# EAGLE design HirigrandeCHINA V2.1 (EAGLE 9.6.2)
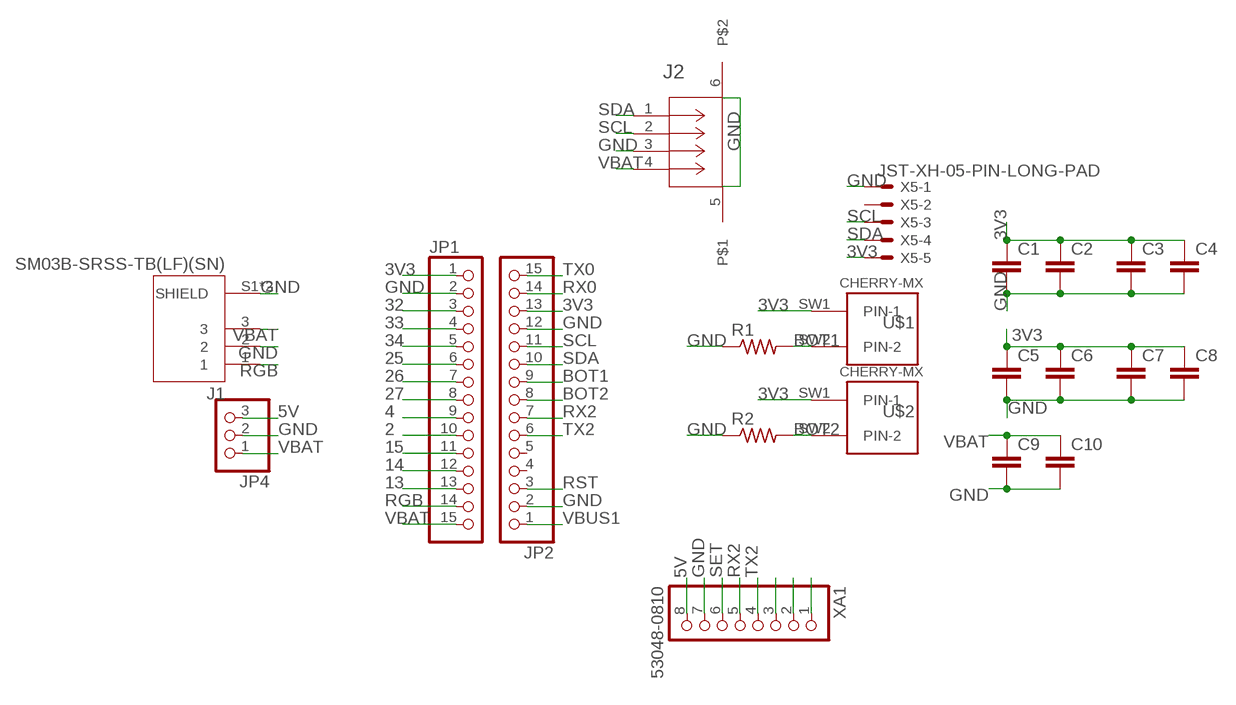
[diagram p0: schematic, sheet 1]

## Parts
C1  C-EUC4532  [C4532]
C2  C-EUC4532  [C4532]
C3  C-EUC4532  [C4532]
C4  C-EUC4532  [C4532]
C5  C-EUC4532  [C4532]
C6  C-EUC4532  [C4532]
C7  C-EUC4532  [C4532]
C8  C-EUC4532  [C4532]
C9  C-EUC4532  [C4532]
C10  C-EUC4532  [C4532]
J1  SM03B-SRSS-TB(LF)(SN)  [JST_SM03B-SRSS-TB(LF)(SN)]
J2  SM04B-SRSS-TB  [CONN_SM04B-SRSS-TB_JST]
JP1  PINHD-1X15  [1X15]
JP2  PINHD-1X15  [1X15]
JP4  PINHD-1X3  [1X03]
R1  R-US_0204/7  [0204/7]
R2  R-US_0204/7  [0204/7]
U$1  CHERRY-MX  [CHERRY-MX]
U$2  CHERRY-MX  [CHERRY-MX]
X5  JST-XH-05-PIN-LONG-PAD  [JST-XH-05-PACKAGE-LONG-PAD]
XA1  53048-0810  [MOLEX_53048-0810]

## Nets
2: JP1.10
3V3: C1.1 C2.1 C3.1 C4.1 C5.1 C6.1 C7.1 C8.1 JP1.1 JP2.13 U$1.SW1(PIN-1) U$2.SW1(PIN-1) X5.5
4: JP1.9
5V: JP4.3 XA1.8
13: JP1.13
14: JP1.12
15: JP1.11
25: JP1.6
26: JP1.7
27: JP1.8
32: JP1.3
33: JP1.4
34: JP1.5
BOT1: JP2.9 R1.2 U$1.SW2(PIN-2)
BOT2: JP2.8 R2.2 U$2.SW2(PIN-2)
GND: C1.2 C2.2 C3.2 C4.2 C5.2 C6.2 C7.2 C8.2 C9.2 C10.2 J1.2 J1.S1(SHIELD) J1.S2(SHIELD) J2.3 J2.5 J2.6 JP1.2 JP2.2 JP2.12 JP4.2 R1.1 R2.1 X5.1 XA1.7
N$6: XA1.3
N$7: XA1.2
N$8: XA1.1
RGB: J1.1 JP1.14
RST: JP2.3
RX0: JP2.14
RX2: JP2.7 XA1.5
SCL: J2.2 JP2.11 X5.3
SDA: J2.1 JP2.10 X5.4
SET: XA1.6
TX0: JP2.15
TX2: JP2.6 XA1.4
VBAT: C9.1 C10.1 J1.3 J2.4 JP1.15 JP4.1
VBUS1: JP2.1
Unconnected: JP2.4 JP2.5 X5.2

## Library data of the parts
C1-C10 = rcl:C-EU: CAPACITOR, European symbol; SPICEPREFIX: C
J1 = SM03B-SRSS-TB_LF__SN_:SM03B-SRSS-TB(LF)(SN): Check availability <https://pricing.snapeda.com/parts/SM03B-SRSS-TB%28LF%29%28SN%29/JST%20Sales%20America%20Inc./view-part?ref=eda>; AVAILABILITY: In Stock; CHECK_PRICES: https://www.snapeda.com/parts/SM03B-SRSS-TB(LF)(SN)/JST/view-part/?ref=eda; DESCRIPTION: Connector Header Surface Mount, Right Angle 3 position 0.039 (1.00mm); MF: JST Sales America Inc.; MP: SM03B-SRSS-TB(LF)(SN); PACKAGE: None; PRICE: None; SNAPEDA_LINK: https://www.snapeda.com/parts/SM03B-SRSS-TB(LF)(SN)/JST/view-part/?ref=snap
J2 = SM04B-SRSS-TB:SM04B-SRSS-TB: Check availability <https://pricing.snapeda.com/parts/SM04B-SRSS-TB/JST%20Sales/view-part?ref=eda>; AVAILABILITY: In Stock; CHECK_PRICES: https://www.snapeda.com/parts/SM04B-SRSS-TB/JST/view-part/?ref=eda; DESCRIPTION: Connector Header Surface Mount, Right Angle 4 position 0.039 (1.00mm); MF: JST Sales; MP: SM04B-SRSS-TB; PACKAGE: None; PRICE: None; SNAPEDA_LINK: https://www.snapeda.com/parts/SM04B-SRSS-TB/JST/view-part/?ref=snap
JP1 JP2 = pinhead:PINHD-1X15: PIN HEADER
JP4 = adafruit:PINHD-1X3: PIN HEADER
R1 R2 = adafruit:R-US_: RESISTOR, American symbol
U$1 U$2 = cherrymx:CHERRY-MX: Cherry MX series keyswitch
X5 = Rembrandt Electronics - JST XH Connectors v1-0:JST-XH-05-PIN: JST XH Connector 2 Pin Wire to board connector. Pitch: 2,54 mm, (0.100") Number of pins: 5 Created by Rembrandt Electronics www.rembrandtelectronics.com
XA1 = ConectorPlantower:53048-0810: 1.25mm Pitch PicoBlade Header, Right Angle, 8 Circuits Check availability <https://pricing.snapeda.com/parts/53048-0810/Molex/view-part?ref=eda>; AVAILABILITY: In Stock; CHECK_PRICES: https://www.snapeda.com/parts/53048-0810/Molex/view-part/?ref=eda; DESCRIPTION: 8 way through board PCB 90deg header | Molex Incorporated 53048-0810; MF: Molex; MP: 53048-0810; PACKAGE: None; PRICE: None; PURCHASE-URL: https://www.snapeda.com/api/url_track_click_mouser/?unipart_id=53851&manufacturer=Molex&part_name=53048-0810&search_term=picoblade 1.25mm header rightangle 8way; SNAPEDA_LINK: https://www.snapeda.com/parts/53048-0810/Molex/view-part/?ref=snap

## Board
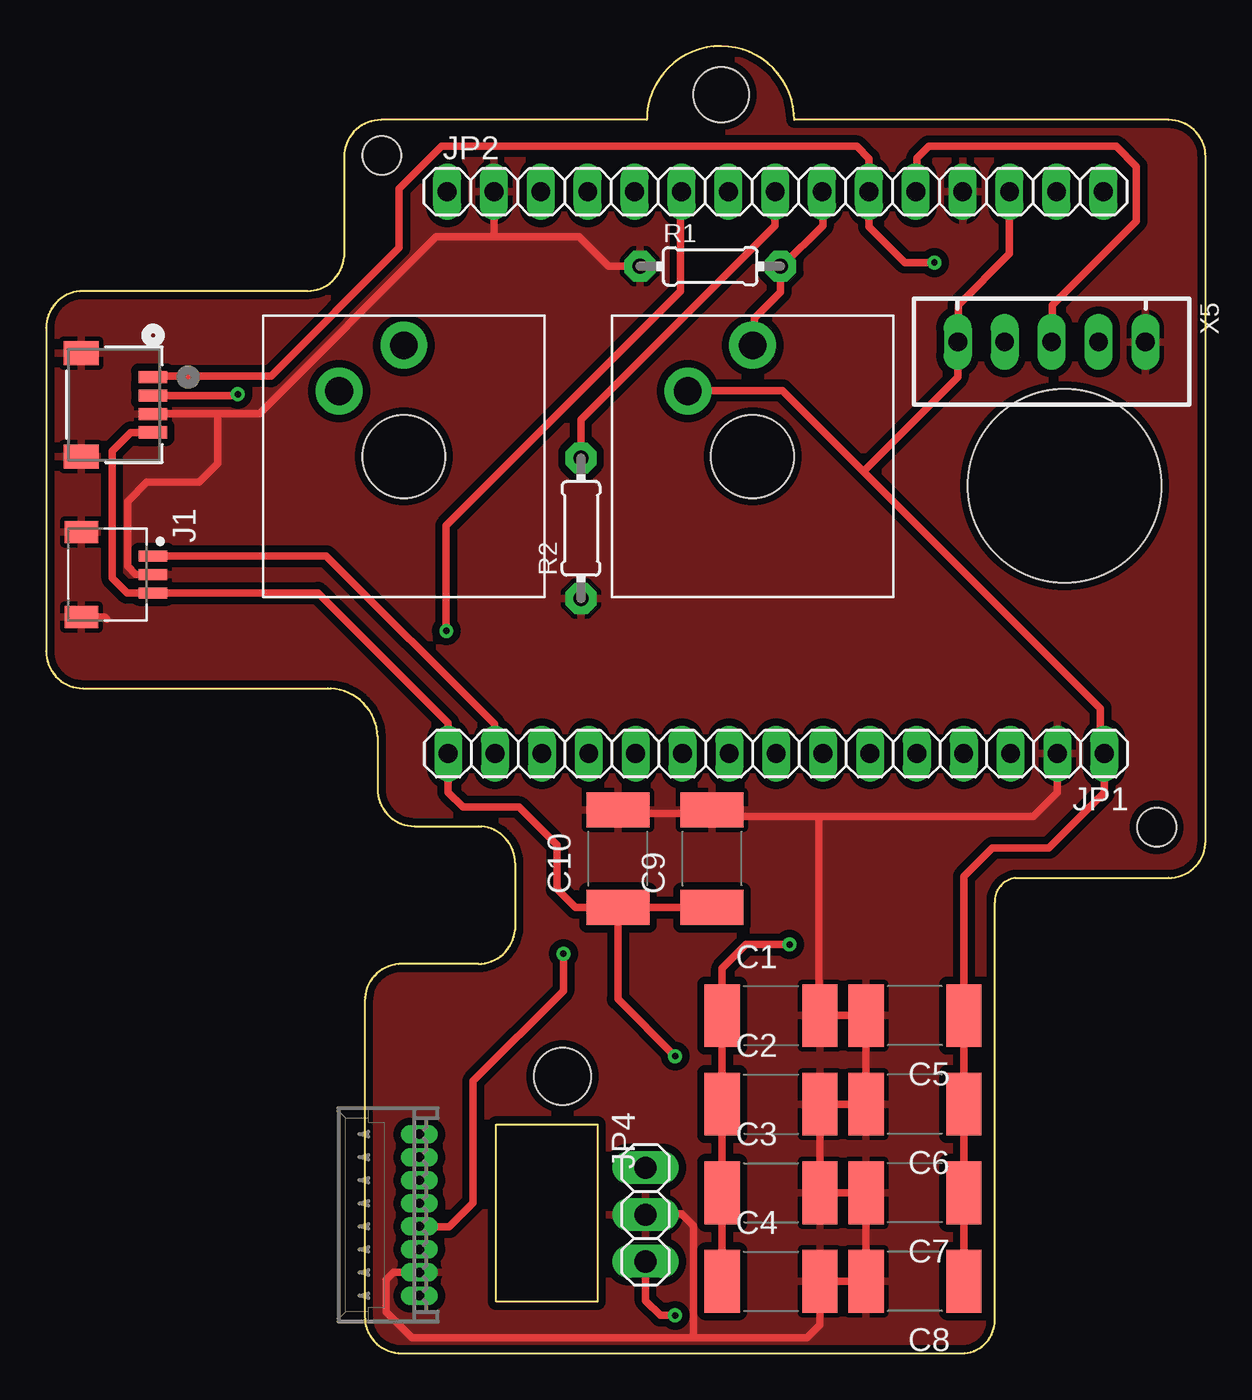
[diagram p1: board, top side]
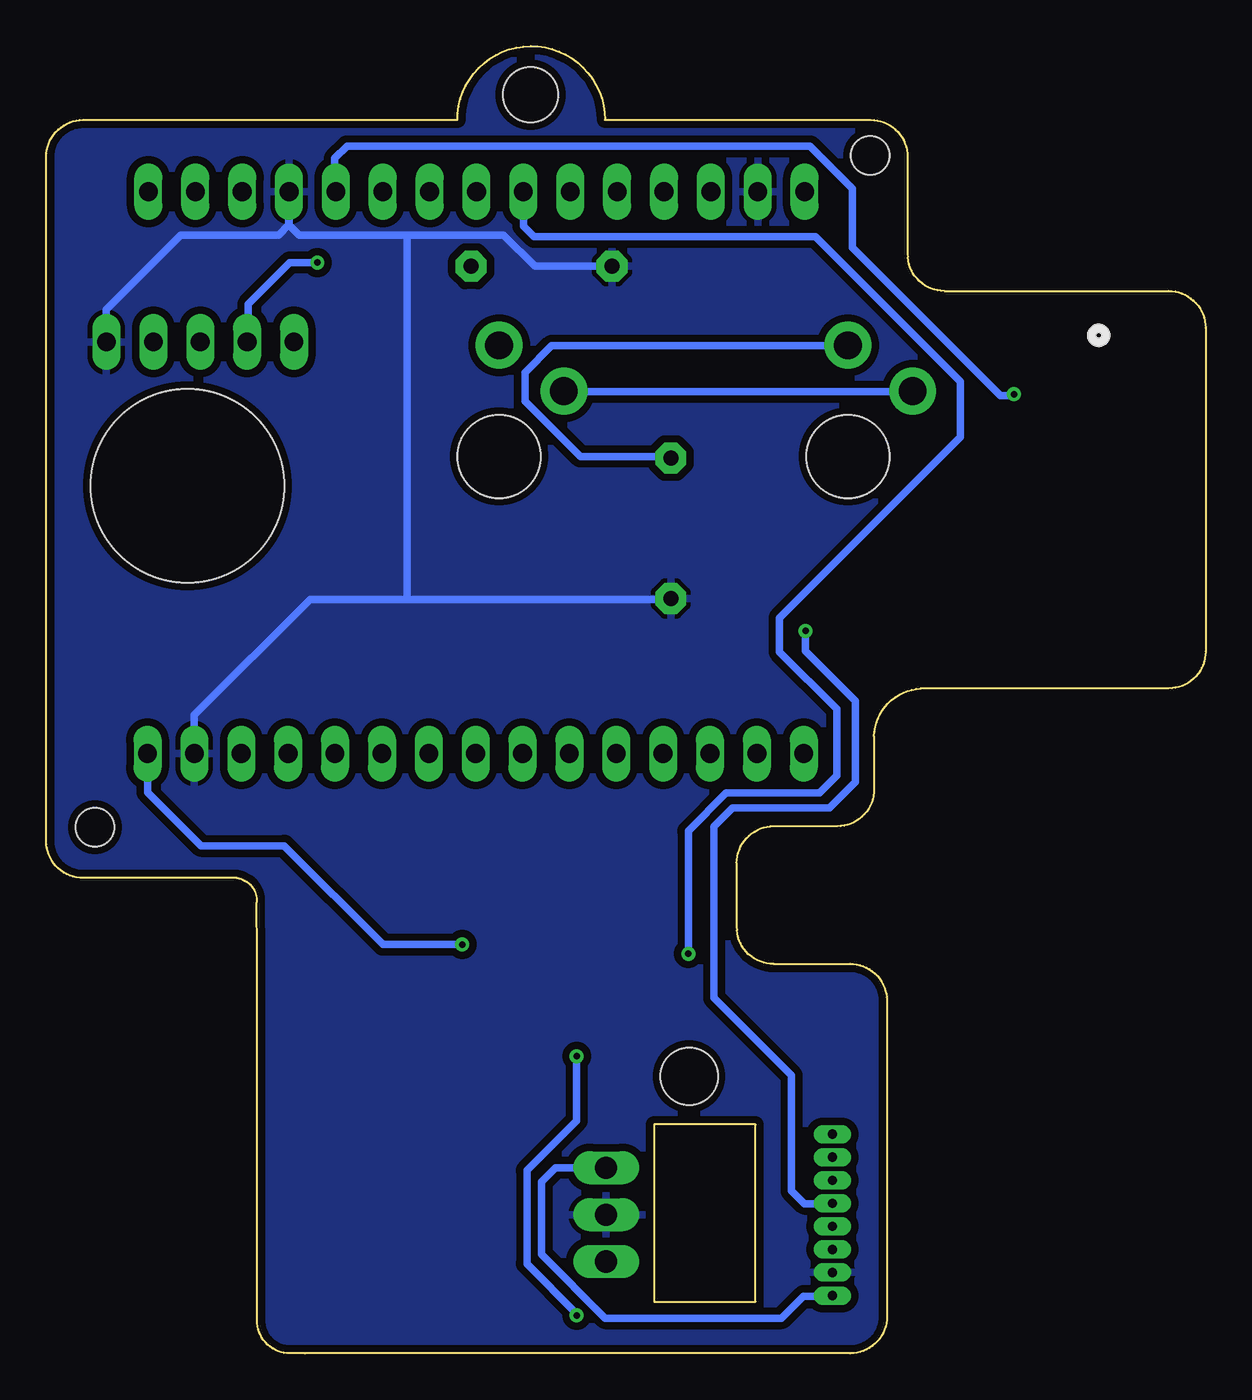
[diagram p2: board, bottom side, seen from below]

Size 62.83 x 70.84 mm. Coordinates in mm from the lower left corner, seen from the top.
Outline: 24.39,2.8 24.39,12.4 29.89,12.4 29.89,2.8 24.39,2.8
Outline: 14.15,57.57 2,57.57 1.83,57.56 arc85 0,55.57 0,38.04 arc90 2,36.04 15.26,36.04 15.44,36.03 arc-85 17.96,33.44 17.96,30.56 17.97,30.39 arc85 19.96,28.56 23.41,28.56 23.59,28.55 arc-85 25.41,26.56 25.41,23.1 25.4,22.93 arc-85 23.41,21.1 19.26,21.1 19.09,21.1 arc85 17.26,19.1 17.26,2 17.27,1.83 arc85 19.26,0 48.81,0 49.78,0.01 arc85 51.41,1.8 51.41,21.66 51.42,24.44 arc-85 52.51,25.76 60.83,25.76 61.01,25.77 arc85 62.83,27.76 62.83,64.84 62.83,65.01 arc85 60.83,66.84 40.55,66.84 40.53,67.18 arc175 32.55,66.84 18.15,66.84 17.98,66.83 arc85 16.15,64.84 16.15,59.57 16.14,59.39 arc-85 14.15,57.57
Copper layers (1*16): Top 0.035mm / dielectric 1.5mm / Bottom 0.035mm
Design rules "default *": minimum track width 0.4mm, minimum drill 0.35mm, track to track 0.4mm, track to pad 0.4mm, pad to pad 0.4mm, via to via 0.4mm, smd to smd 6mil, copper to edge 0.4mm, drill to drill 6mil, minimum pad ring 10mil, minimum via ring 8mil, stop-mask expansion 4mil, vias tented up to drill 0mil, thermal gap 10mil
Holes 4.5 mm at 38.29,48.6 19.39,48.6
Holes 10.5 mm at 55.19,47
Holes 2.1 mm at 18.19,64.9 60.19,28.5
Holes 3.1 mm at 27.99,15
Holes 3 mm at 36.59,68.2

### Footprints (pad centres in the part's own frame; a part is rotated, then mirrored left to right if it is on the bottom)
C4532 = smd 1.9 x 3.4: 1 -2.65,0; 2 2.65,0
JST_SM03B-SRSS-TB(LF)(SN) = smd 0.6 x 1.55: 1 -1,0; 2 0,0; 3 1,0 | smd 1.2 x 1.8: S1 -2.3,-3.875; S2 2.3,-3.875
CONN_SM04B-SRSS-TB_JST = smd 0.66 x 1.549: 1 1.5,-2.099; 2 0.5,-2.099; 3 -0.5,-2.099; 4 -1.5,-2.099 | smd 1.295 x 1.905: 5 -2.8,1.776; 6 2.8,1.776
1X15 = drill 1.016 long: 1 -17.78,0; 2 -15.24,0; 3 -12.7,0; 4 -10.16,0; 5 -7.62,0; 6 -5.08,0; 7 -2.54,0; 8 0,0; 9 2.54,0; 10 5.08,0; 11 7.62,0; 12 10.16,0; 13 12.7,0; 14 15.24,0; 15 17.78,0
1X03 = drill 1.2 pad 1.676 long: 1 -2.54,0; 2 0,0; 3 2.54,0
0204/7 = drill 0.813 pad 1.676 octagon: 1 -3.81,0; 2 3.81,0
CHERRY-MX = drill 1.5 pad 2.54: SW1 -3.51,3.54; SW2 0,6.02 | hole 4.5: 0,0
JST-XH-05-PACKAGE-LONG-PAD = drill 1.016 long: 1 -5.08,0; 2 -2.54,0; 3 0,0; 4 2.54,0; 5 5.08,0
MOLEX_53048-0810 = drill 0.5 pad 0.762 long: 1 4.375,0.02; 2 3.125,0.02; 3 1.875,0.02; 4 0.625,0.02; 5 -0.625,0.02; 6 -1.875,0.02; 7 -3.125,0.02; 8 -4.375,0.02

### Placement (x,y rotation side)
C1  39.29,18.3 0 top
C2  39.29,13.5 0 top
C3  39.29,8.7 0 top
C4  39.29,3.9 0 top
C5  47.09,18.3 180 top
C6  47.09,13.5 180 top
C7  47.09,8.7 180 top
C8  47.09,3.9 180 top
C9  36.09,26.8 90 top
C10  30.99,26.8 90 top
J1  5.79,42.2 270 top
J2  3.69,51.4 90 top
JP1  39.56,32.5 180 top
JP2  39.51,62.95 0 top
JP4  32.49,7.52 90 top
R1  35.99,58.9 0 top
R2  28.99,44.7 90 top
U$1  38.29,48.6 0 top
U$2  19.39,48.6 0 top
X5  54.49,54.8 180 top
XA1  20.24,7.5 90 top

### Tracks (layer width: path | path; a pad name or v marks a point on that pad's centre or on a via)
3V3  (via drill 0.35)
  Top 0.4: 49.14,8.6 49.65,8.69 | 49.65,8.69 C7.1 C8.1 | 49.14,18.35 C5.1 | 49.14,18.1 C5.1 | 49.14,13.35 49.71,13.5 | 49.71,13.5 C6.1 49.74,8.77 49.65,8.69 | JP2.13 52.21,59.58 49.44,56.8 49.44,54.83 X5.5 49.41,52.9 44.3,47.79 | U$1.SW1 34.81,52.18 39.91,52.18 44.3,47.79 | 44.3,47.79 57.14,34.95 57.14,32.6 JP1.1 57.34,30.4 54.34,27.4 51.28,27.4 49.74,25.85 C5.1 | C5.1 49.74,13.52 49.71,13.5 | C4.1 C3.1 C2.1 C1.1 36.64,20.85 37.94,22.15 v40.29,22.15 | C4.1 36.64,3.35 36.59,3.3 36.59,3.85 C4.1
  Bottom 0.4: v40.29,22.15 44.59,22.15 49.93,27.5 54.44,27.5 57.34,30.4 JP1.1 | U$2.SW1 15.89,52.1 34.64,52.1 U$1.SW1
5V
  Bottom 0.4: XA1.8 20.24,3.1 21.79,3.1 22.99,1.9 32.54,1.9 35.99,5.35 35.99,9.3 35.24,10.05 JP4.3
BOT1
  Top 0.4: JP2.9 42.09,62.92 42.09,61.1 39.89,58.9 R1.2 39.8,57.51 38.39,56.1 38.39,54.85 U$1.SW2
BOT2
  Top 0.4: JP2.8 39.49,62.93 39.49,61.1 28.99,50.6 R2.2
  Bottom 0.4: U$2.SW2 19.39,54.6 35.44,54.6 36.89,53.15 36.89,51.6 33.89,48.6 29.14,48.6 R2.2
GND
  Top 0.4: 44.8,8.68 C7.2 C8.2 C4.2 | 44.8,8.68 45.09,8.65 | 42.39,13.6 41.89,13.6 | 41.89,13.6 41.29,13.6 C2.2 | 45.14,13.6 C6.2 | 42.39,8.6 C3.2 | 42.39,13.4 C2.2 | XA1.7 18.82,4.38 18.42,3.98 18.42,2.27 19.84,0.85 35.09,0.85 | JP4.2 32.52,7.55 34.44,7.55 35.09,6.9 35.09,0.85 | 42.39,4.04 C4.2 | C10.2 31.04,29.25 36.02,29.25 C9.2 36.11,29.1 41.89,29.1 | JP1.2 54.8,30.4 53.5,29.1 41.89,29.1 | R1.1 30.49,58.9 28.89,60.5 24.39,60.5 | 24.39,60.5 21.14,60.5 11.57,50.93 9.29,50.93 | 24.39,60.5 24.26,60.63 24.26,62.94 JP2.2 | C6.2 C5.2 C1.2 41.89,18.35 41.89,29.1 | C6.2 41.99,13.5 41.89,13.6 | C2.2 C3.2 | C3.2 44.77,8.7 44.8,8.68 | 35.09,0.85 41.24,0.85 41.94,1.55 C4.2 | J1.2 4.86,42.2 4.41,42.66 4.41,46.15 5.46,47.2 8.29,47.2 9.29,48.2 9.29,50.93 | J2.3 5.81,50.93 9.29,50.93 | J1.S2 3.19,39.9 3.29,39.8
  Bottom 0.4: 43.29,40.85 48.54,40.85 54.8,34.59 JP1.2 | 43.29,40.85 29.14,40.85 R2.1 | X5.1 59.59,54.82 59.59,56.55 55.54,60.6 50.24,60.6 49.69,61.15 49.69,62.94 JP2.12 49.67,61.14 49.14,60.6 43.29,60.6 | 43.29,60.6 38.04,60.6 36.34,58.9 R1.1 | 43.29,60.6 43.29,40.85
  pour Top: -1.21,70.9 58.89,70.9 64.49,65.3 64.49,27.1 61.39,24 53.79,24 52.19,22.4 52.19,1.2 49.19,-1.8 18.69,-1.8 16.39,0.5 16.39,33.5 14.89,35 1.39,35 -1.71,38.1 -1.71,56.6 -1.21,57.1
  pour Bottom: 0.39,59.2 13.49,59.2 15.19,60.9 15.19,65.4 14.99,65.6 20.69,71.3 57.89,71.3 64.49,64.7 64.49,27.1 61.79,24.4 55.49,24.4 52.89,21.8 52.89,2.2 49.29,-1.4 19.09,-1.4 14.59,3.1 14.59,17.3 14.59,31.9 12.49,34 0.19,34 -2.31,36.5 -2.31,56.5
RGB
  Top 0.4: JP1.14 24.29,32.53 24.29,34.1 15.19,43.2 J1.1
RX2  (via drill 0.35)
  Top 0.4: v28.04,21.65 28.04,19.65 23.14,14.75 23.14,8.15 21.84,6.85 20.24,6.85 XA1.5
  Bottom 0.4: v28.04,21.65 28.04,28.3 25.99,30.35 20.94,30.35 19.99,31.3 19.99,34.9 23.09,38 23.09,39.85 13.29,49.65 13.29,52.65 21.14,60.5 36.39,60.5 36.97,61.09 JP2.7
SCL  (via drill 0.35)
  Top 0.4: X5.3 54.54,54.82 54.54,56.8 59.09,61.35 59.09,64.3 57.99,65.4 47.84,65.4 47.19,64.76 JP2.11 | J2.2 10.31,51.9 v10.39,51.98
  Bottom 0.4: v10.39,51.98 10.46,51.9 11.14,51.9 19.14,59.9 19.14,63.1 21.44,65.4 46.54,65.4 47.19,64.75 JP2.11
SDA  (via drill 0.35)
  Top 0.4: v48.14,59.1 46.54,59.1 44.59,61.05 JP2.10 44.59,64.75 43.94,65.4 21.44,65.4 19.14,63.1 19.14,59.9 12.19,52.95 7.29,52.95 7.09,52.95 5.83,52.95 J2.1
  Bottom 0.4: v48.14,59.1 49.64,59.1 51.89,56.85 51.89,54.85 X5.4
TX2  (via drill 0.35)
  Top 0.4: v21.69,39.15 21.69,44.85 34.39,57.55 34.39,62.85 JP2.6
  Bottom 0.4: v21.69,39.15 21.69,38.05 18.99,35.35 18.99,30.95 20.39,29.55 25.64,29.55 26.64,28.55 26.64,19.25 22.44,15.05 22.44,8.8 21.74,8.1 20.24,8.1 XA1.4
VBAT  (via drill 0.35)
  Top 0.4: C10.1 28.69,24.15 27.69,25.15 27.69,27.55 25.64,29.6 22.58,29.6 21.78,30.4 JP1.15 21.78,34.16 14.74,41.2 J1.3 4.39,41.2 3.59,42 3.59,48.91 4.58,49.9 J2.4 | C10.1 C9.1 35.89,24.85 | JP4.1 32.49,2.85 33.29,2.05 v34.09,2.05 | C10.1 30.99,19.2 v34.09,16.1
  Bottom 0.4: v34.09,16.1 34.09,12.6 36.79,9.9 36.79,4.85 34.09,2.15 v34.09,2.05